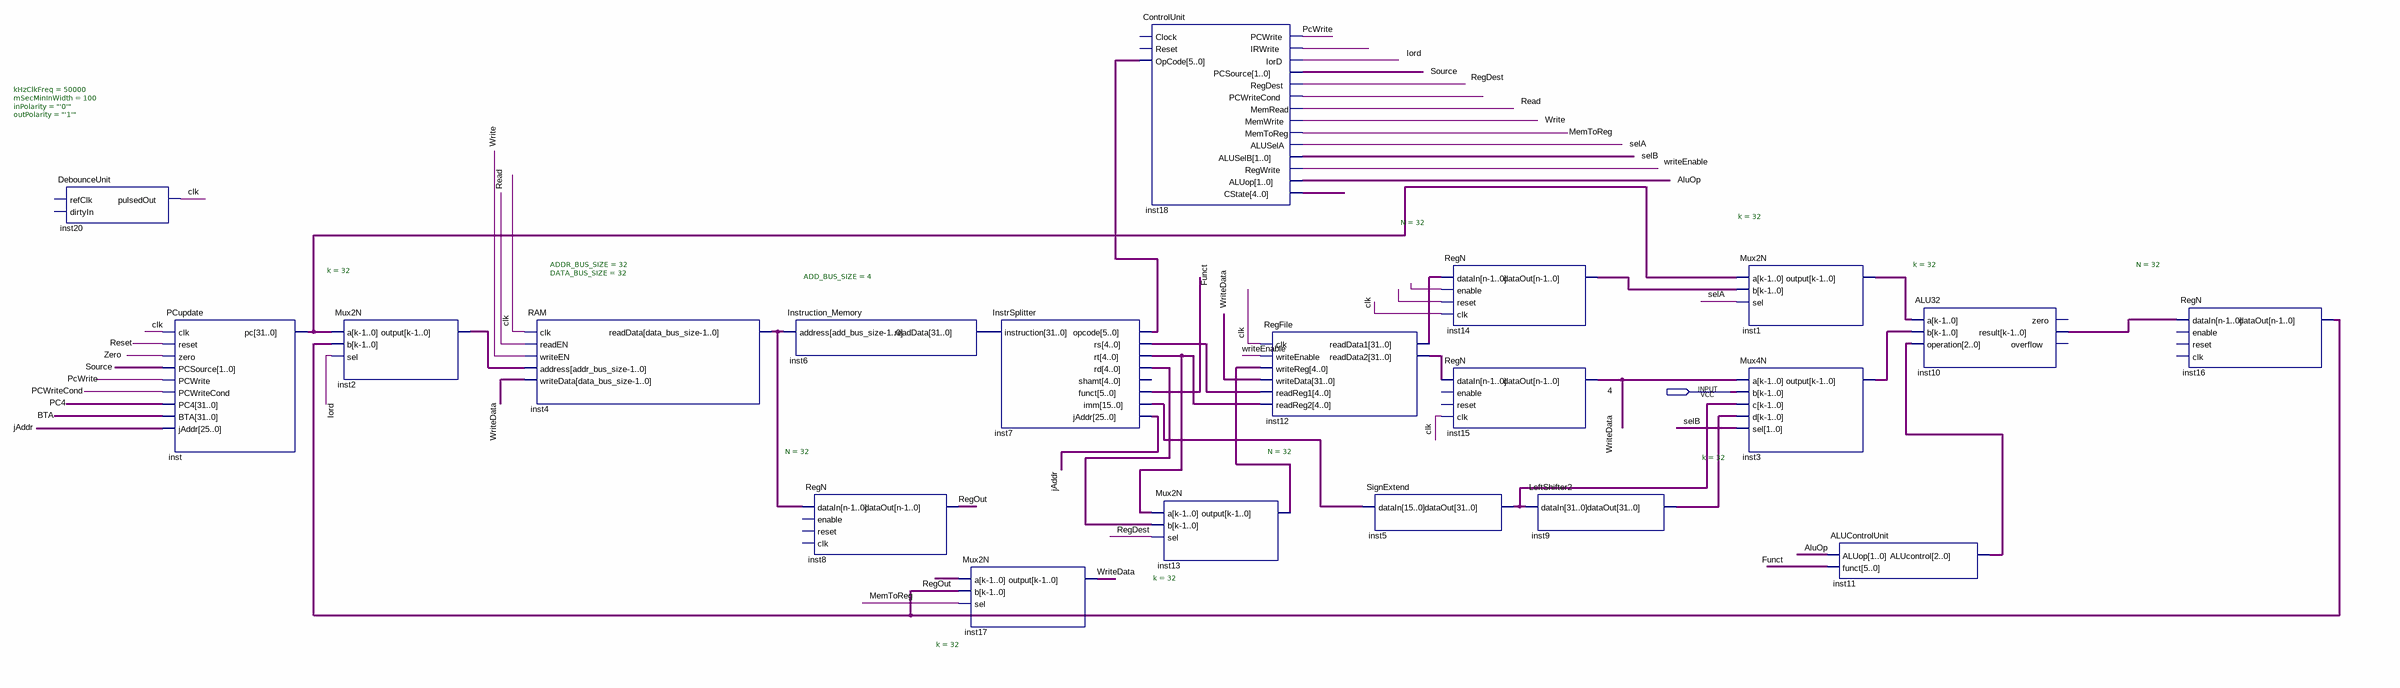
[diagram p0: schematic sheet]
// Quartus schematic mips_multi_cycle.bdf as structural Verilog: 20 symbols, 1 pins
module mips_multi_cycle (
  input  \4 
);

  wire AluOp, BTA, clk, Funct, inst18_irwrite, inst18_pcwritecond, Iord, jAddr, MemToReg, PC4, PcWrite,
       PCWriteCond, Read, RegDest, RegOut, Reset, selA, selB, Source, undriven_2, undriven_3, Write,
       WriteData, writeEnable, Zero;
  wire [2:0] inst11_alucontrol;
  wire [4:0] inst7_rs, inst18_cstate;
  wire [5:0] inst7_opcode;
  wire [15:0] inst7_imm;
  wire [31:0] inst1_output, inst2_output, inst3_output, inst4_readdata, inst5_dataout, inst6_readdata,
       inst7_rd, inst7_rt, inst9_dataout, inst10_result, inst12_readdata1, inst12_readdata2, inst13_output,
       inst14_dataout, inst16_dataout, inst_pc, undriven;

  DebounceUnit #(.kHzClkFreq(50000), .mSecMinInWidth(100), .inPolarity("'0'"), .outPolarity("'1'")) inst20 (.pulsedOut(clk));  // open: refClk, dirtyIn
  PCupdate inst (
    .clk(clk), .reset(Reset), .zero(Zero), .PCSource({2{Source}}), .PCWrite(PcWrite),
    .PCWriteCond(PCWriteCond), .PC4({32{PC4}}), .BTA({32{BTA}}), .jAddr({26{jAddr}}), .pc(inst_pc));
  Mux2N #(.k(32)) inst2 (.a(inst_pc), .b(inst16_dataout), .sel(Iord), .\output (inst2_output));
  RAM #(.ADDR_BUS_SIZE(32), .DATA_BUS_SIZE(32)) inst4 (
    .clk(clk), .readEN(Read), .writeEN(Write), .address(inst2_output), .writeData({32{WriteData}}),
    .readData(inst4_readdata));
  Instruction_Memory #(.ADD_BUS_SIZE(4)) inst6 (.address(inst4_readdata), .readData(inst6_readdata));
  RegN #(.N(32)) inst8 (.dataIn(inst4_readdata), .dataOut(RegOut));  // open: enable, reset, clk
  Mux2N #(.k(32)) inst17 (.a({32{RegOut}}), .b(inst16_dataout), .sel(MemToReg), .\output (WriteData));
  InstrSplitter inst7 (
    .instruction(inst6_readdata), .opcode(inst7_opcode), .rs(inst7_rs), .rt(inst7_rt), .rd(inst7_rd),
    .funct(Funct), .imm(inst7_imm), .jAddr(jAddr));  // open: shamt
  ControlUnit inst18 (
    .OpCode(inst7_opcode), .PCWrite(PcWrite), .IRWrite(inst18_irwrite), .IorD(Iord), .PCSource(Source),
    .RegDest(RegDest), .PCWriteCond(inst18_pcwritecond), .MemRead(Read), .MemWrite(Write),
    .MemToReg(MemToReg), .ALUSelA(selA), .ALUSelB(selB), .RegWrite(writeEnable), .ALUop(AluOp),
    .CState(inst18_cstate));  // open: Clock, Reset
  Mux2N #(.k(32)) inst13 (.a(inst7_rt), .b(inst7_rd), .sel(RegDest), .\output (inst13_output));
  RegFile inst12 (
    .clk(clk), .writeEnable(writeEnable), .writeReg(inst13_output), .writeData({32{WriteData}}),
    .readReg1(inst7_rs), .readReg2(inst7_rt), .readData1(inst12_readdata1), .readData2(inst12_readdata2));
  SignExtend inst5 (.dataIn(inst7_imm), .dataOut(inst5_dataout));
  RegN #(.N(32)) inst14 (
    .dataIn(inst12_readdata1), .enable(undriven_3), .reset(undriven_2), .clk(clk), .dataOut(inst14_dataout));
  RegN #(.N(32)) inst15 (.dataIn(inst12_readdata2), .clk(clk), .dataOut(WriteData));  // open: enable, reset
  LeftShifter2 inst9 (.dataIn(inst5_dataout), .dataOut(inst9_dataout));
  Mux2N #(.k(32)) inst1 (.a(inst_pc), .b(inst14_dataout), .sel(selA), .\output (inst1_output));
  Mux4N #(.k(32)) inst3 (
    .a({32{WriteData}}), .b(undriven), .c(inst5_dataout), .d(inst9_dataout), .sel({2{selB}}),
    .\output (inst3_output));
  ALUControlUnit inst11 (.ALUop({2{AluOp}}), .funct({6{Funct}}), .ALUcontrol(inst11_alucontrol));
  ALU32 #(.k(32)) inst10 (
    .a(inst1_output), .b(inst3_output), .operation(inst11_alucontrol), .result(inst10_result));  // open: zero, overflow
  RegN #(.N(32)) inst16 (.dataIn(inst10_result), .dataOut(inst16_dataout));  // open: enable, reset, clk
endmodule
